# Altium project Honolulu.PrjPcb (part 1 of 3)
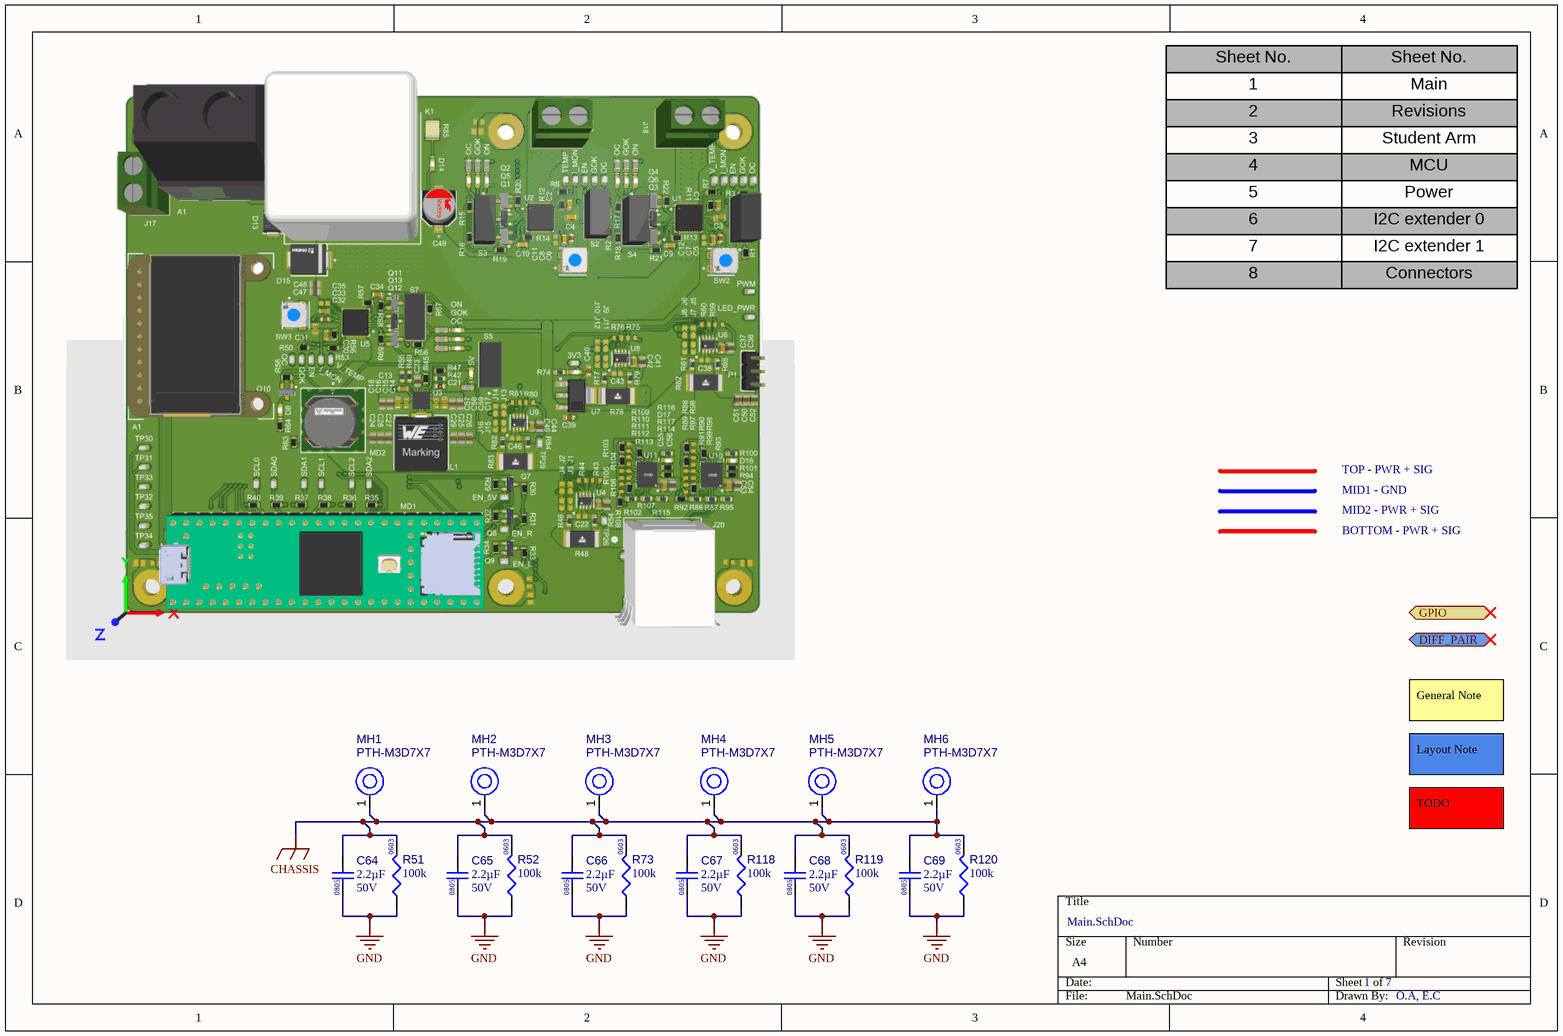
[diagram p0: Main.SchDoc]
8 sheets, 299 parts. Net scope: flat (ports and power ports of the same name join across sheets).
Board file: PCB1.PcbDoc
Sheets:
  Main.SchDoc
  Revisions.SchDoc
  Student Arm.SchDoc
  MCU.SchDoc
  Power.SchDoc
  I2C extender 0.SchDoc
  I2C extender 1.SchDoc
  Connectors.SchDoc

## Sheet Main.SchDoc: =DocumentName
size A4; SheetNumber: 1; SheetTotal: 7

### Parts
C64  value 2.2µF  Rated DC Voltage (URdc): 50V  Case/Package: 0805  [FP-CL21-IPC_C]  (hidden comment: CL21A225KBFNNNE)
C65  value 2.2µF  Rated DC Voltage (URdc): 50V  Case/Package: 0805  [FP-CL21-IPC_C]  (hidden comment: CL21A225KBFNNNE)
C66  value 2.2µF  Rated DC Voltage (URdc): 50V  Case/Package: 0805  [FP-CL21-IPC_C]  (hidden comment: CL21A225KBFNNNE)
C67  value 2.2µF  Rated DC Voltage (URdc): 50V  Case/Package: 0805  [FP-CL21-IPC_C]  (hidden comment: CL21A225KBFNNNE)
C68  value 2.2µF  Rated DC Voltage (URdc): 50V  Case/Package: 0805  [FP-CL21-IPC_C]  (hidden comment: CL21A225KBFNNNE)
C69  value 2.2µF  Rated DC Voltage (URdc): 50V  Case/Package: 0805  [FP-CL21-IPC_C]  (hidden comment: CL21A225KBFNNNE)
MH1  PTH-M3D7X7  [PTH-M2D5X5]
MH2  PTH-M3D7X7  [PTH-M2D5X5]
MH3  PTH-M3D7X7  [PTH-M2D5X5]
MH4  PTH-M3D7X7  [PTH-M2D5X5]
MH5  PTH-M3D7X7  [PTH-M2D5X5]
MH6  PTH-M3D7X7  [PTH-M2D5X5]
R51  value 100k  Case/Package: 0603  [RESC1608X55X25NL10T15]  (hidden comment: RC0603FR-07100KL)
R52  value 100k  Case/Package: 0603  [RESC1608X55X25NL10T15]  (hidden comment: RC0603FR-07100KL)
R73  value 100k  Case/Package: 0603  [RESC1608X55X25NL10T15]  (hidden comment: RC0603FR-07100KL)
R118  value 100k  Case/Package: 0603  [RESC1608X55X25NL10T15]  (hidden comment: RC0603FR-07100KL)
R119  value 100k  Case/Package: 0603  [RESC1608X55X25NL10T15]  (hidden comment: RC0603FR-07100KL)
R120  value 100k  Case/Package: 0603  [RESC1608X55X25NL10T15]  (hidden comment: RC0603FR-07100KL)

### Ports
DIFF_PAIR (bidir), GPIO (bidir)

### Nets
CHASSIS: C64.2 C65.2 C66.2 C67.2 C68.2 C69.2 MH1.1(H1) MH2.1(H1) MH3.1(H1) MH4.1(H1) MH5.1(H1) MH6.1(H1) R51.2 R52.2 R73.2 R118.2 R119.2 R120.2
GND: C64.1 C65.1 C66.1 C67.1 C68.1 C69.1 R51.1 R52.1 R73.1 R118.1 R119.1 R120.1

### Notes on the sheet
- Sheet No.
- 1
- Main
- 2
- 3
- 4
- Revisions
- Student Arm
- MCU
- 5
- 6
- Power
- I2C extender 0
- 7
- 8
- I2C extender 1
- Connectors
- TOP - PWR + SIG
- MID1 - GND
- MID2 - PWR + SIG
- BOTTOM - PWR + SIG
- General Note
- Layout Note
- TODO
- O.A, E.C

### Library data of the parts
C64-C69 = CMP-001-00099-1: Ceramic Capacitor, Multilayer, Ceramic, 50V, 10% +Tol, 10% -Tol, X5R, 15% TC, 2.2uF, Surface Mount, 0805; Multilayer: Yes; Dielectric Material: Ceramic; Length: 2mm; Pins: 2; Tolerance  (fill in as +-): 10%; RoHS Compliant: Yes; Package Style: SMTMeter; Reach SVHC Compliant: Yes; Min Operating Temperature: -55°C; Temperature Characteristics Code: X5R; Tolerance (fill in as +-): 10%; Capacitor Type: Ceramic; Width: 1.25mm; Terminal Finish: Nickel; Termination: Wraparound; Package Shape: Rectangular; Packaging: Tape and Reel; Mounting Technology: Surface Mount; JESD-609 Code: e3; Height: 1.25mm; Max Operating Temperature: 85°C
MH1-MH6 = CMP-00028-00009-3: M3 PTH (3.3mm), 7mm pad; Pins: 1
R51 R52 R73 R118-R120 = CMP-009-00195-1: Fixed Resistor, Metal Glaze/thick Film, 0.1W, 100000ohm, 75V, 1% +/-Tol, 100ppm/Cel, Surface Mount, 0603; Power: 100mW; Voltage Rating: 50V; Package Length: 1.6mm; Package Height: 0.45mm; Rated Temperature: 70°C; Package Width: 0.8mm; Temperature Coefficient: 100ppm/°C; Additional Feature: LASER TRIMMABLE; Pins: 2; Reach SVHC Compliant: Yes; Terminal Finish: Nickel; RoHS Compliant: Yes; Technology: METAL GLAZE/THICK FILM; JESD-609 Code: e3; Working Voltage: 75V; Construction: Chip; Mounting Technology: Surface Mount; Package Style: SMTMeter; Packaging: Tape and Reel; Min Operating Temperature: -55°C; Termination: Wraparound; Tolerance: 1%; Package Shape: Rectangular; Max Operating Temperature: 155°C; Resistor Type: FIXED RESISTOR

## Sheet Revisions.SchDoc
size A4; SheetNumber: 2; SheetTotal: 5
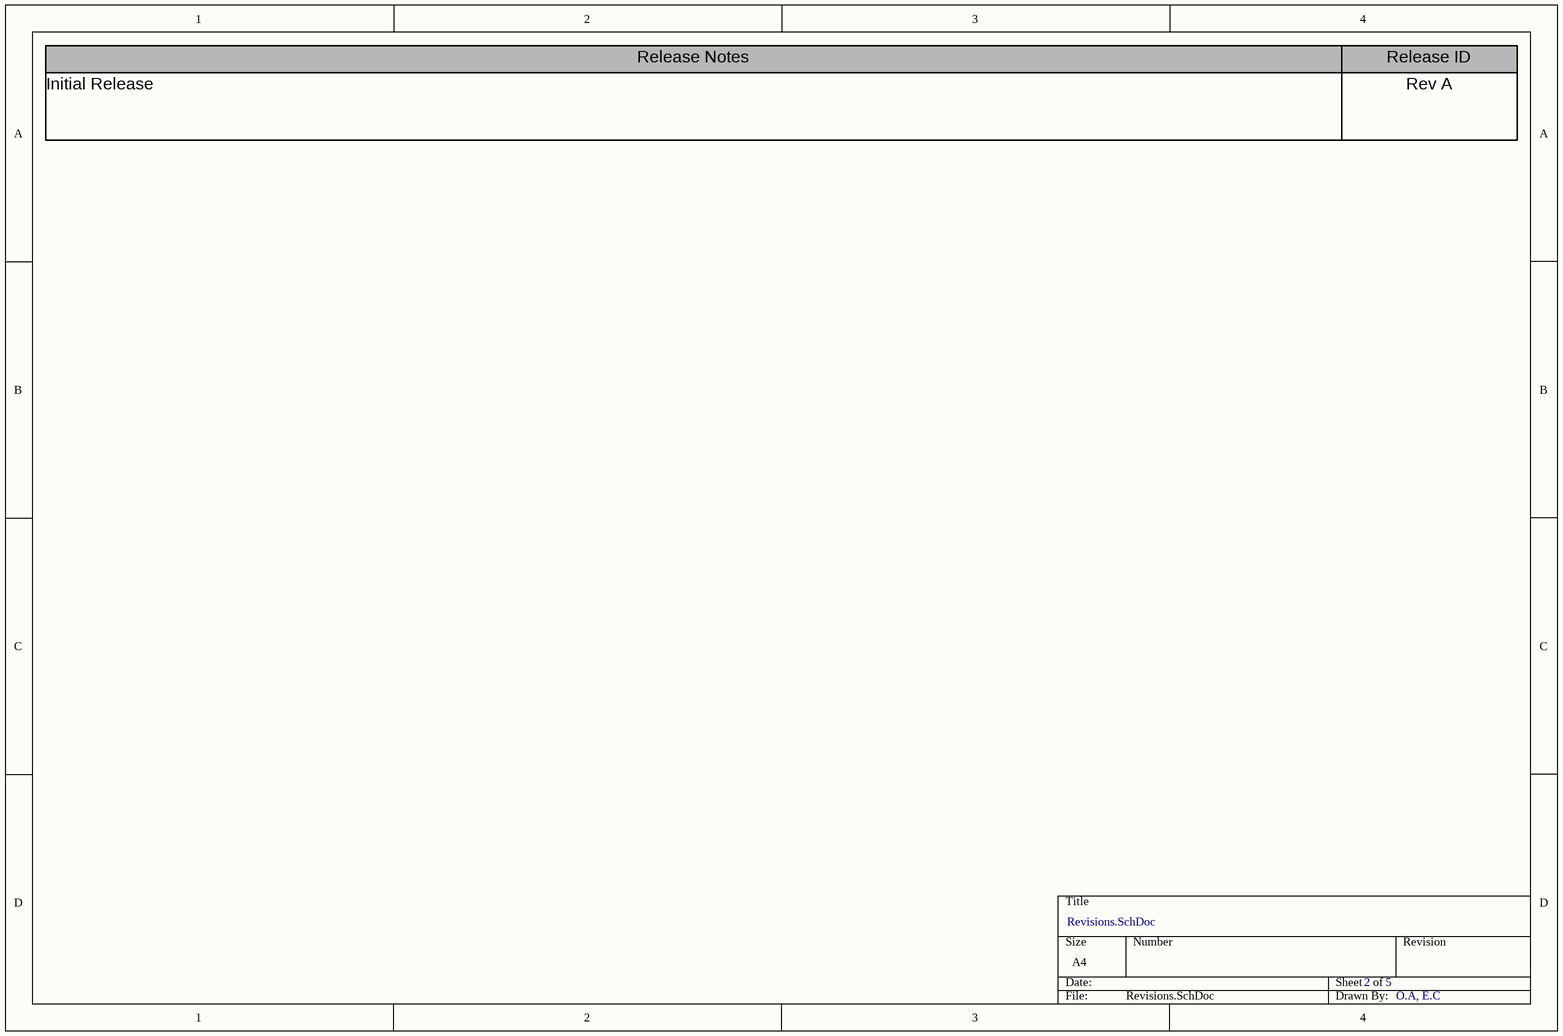
[diagram p1: Revisions.SchDoc]

### Notes on the sheet
- Release Notes
- Release ID
- Initial Release
- Rev A
- O.A, E.C

## Sheet Student Arm.SchDoc
size 431 x 279 mm; DrawnBy: O. A., E. C.; SheetNumber: 1; SheetTotal: 6
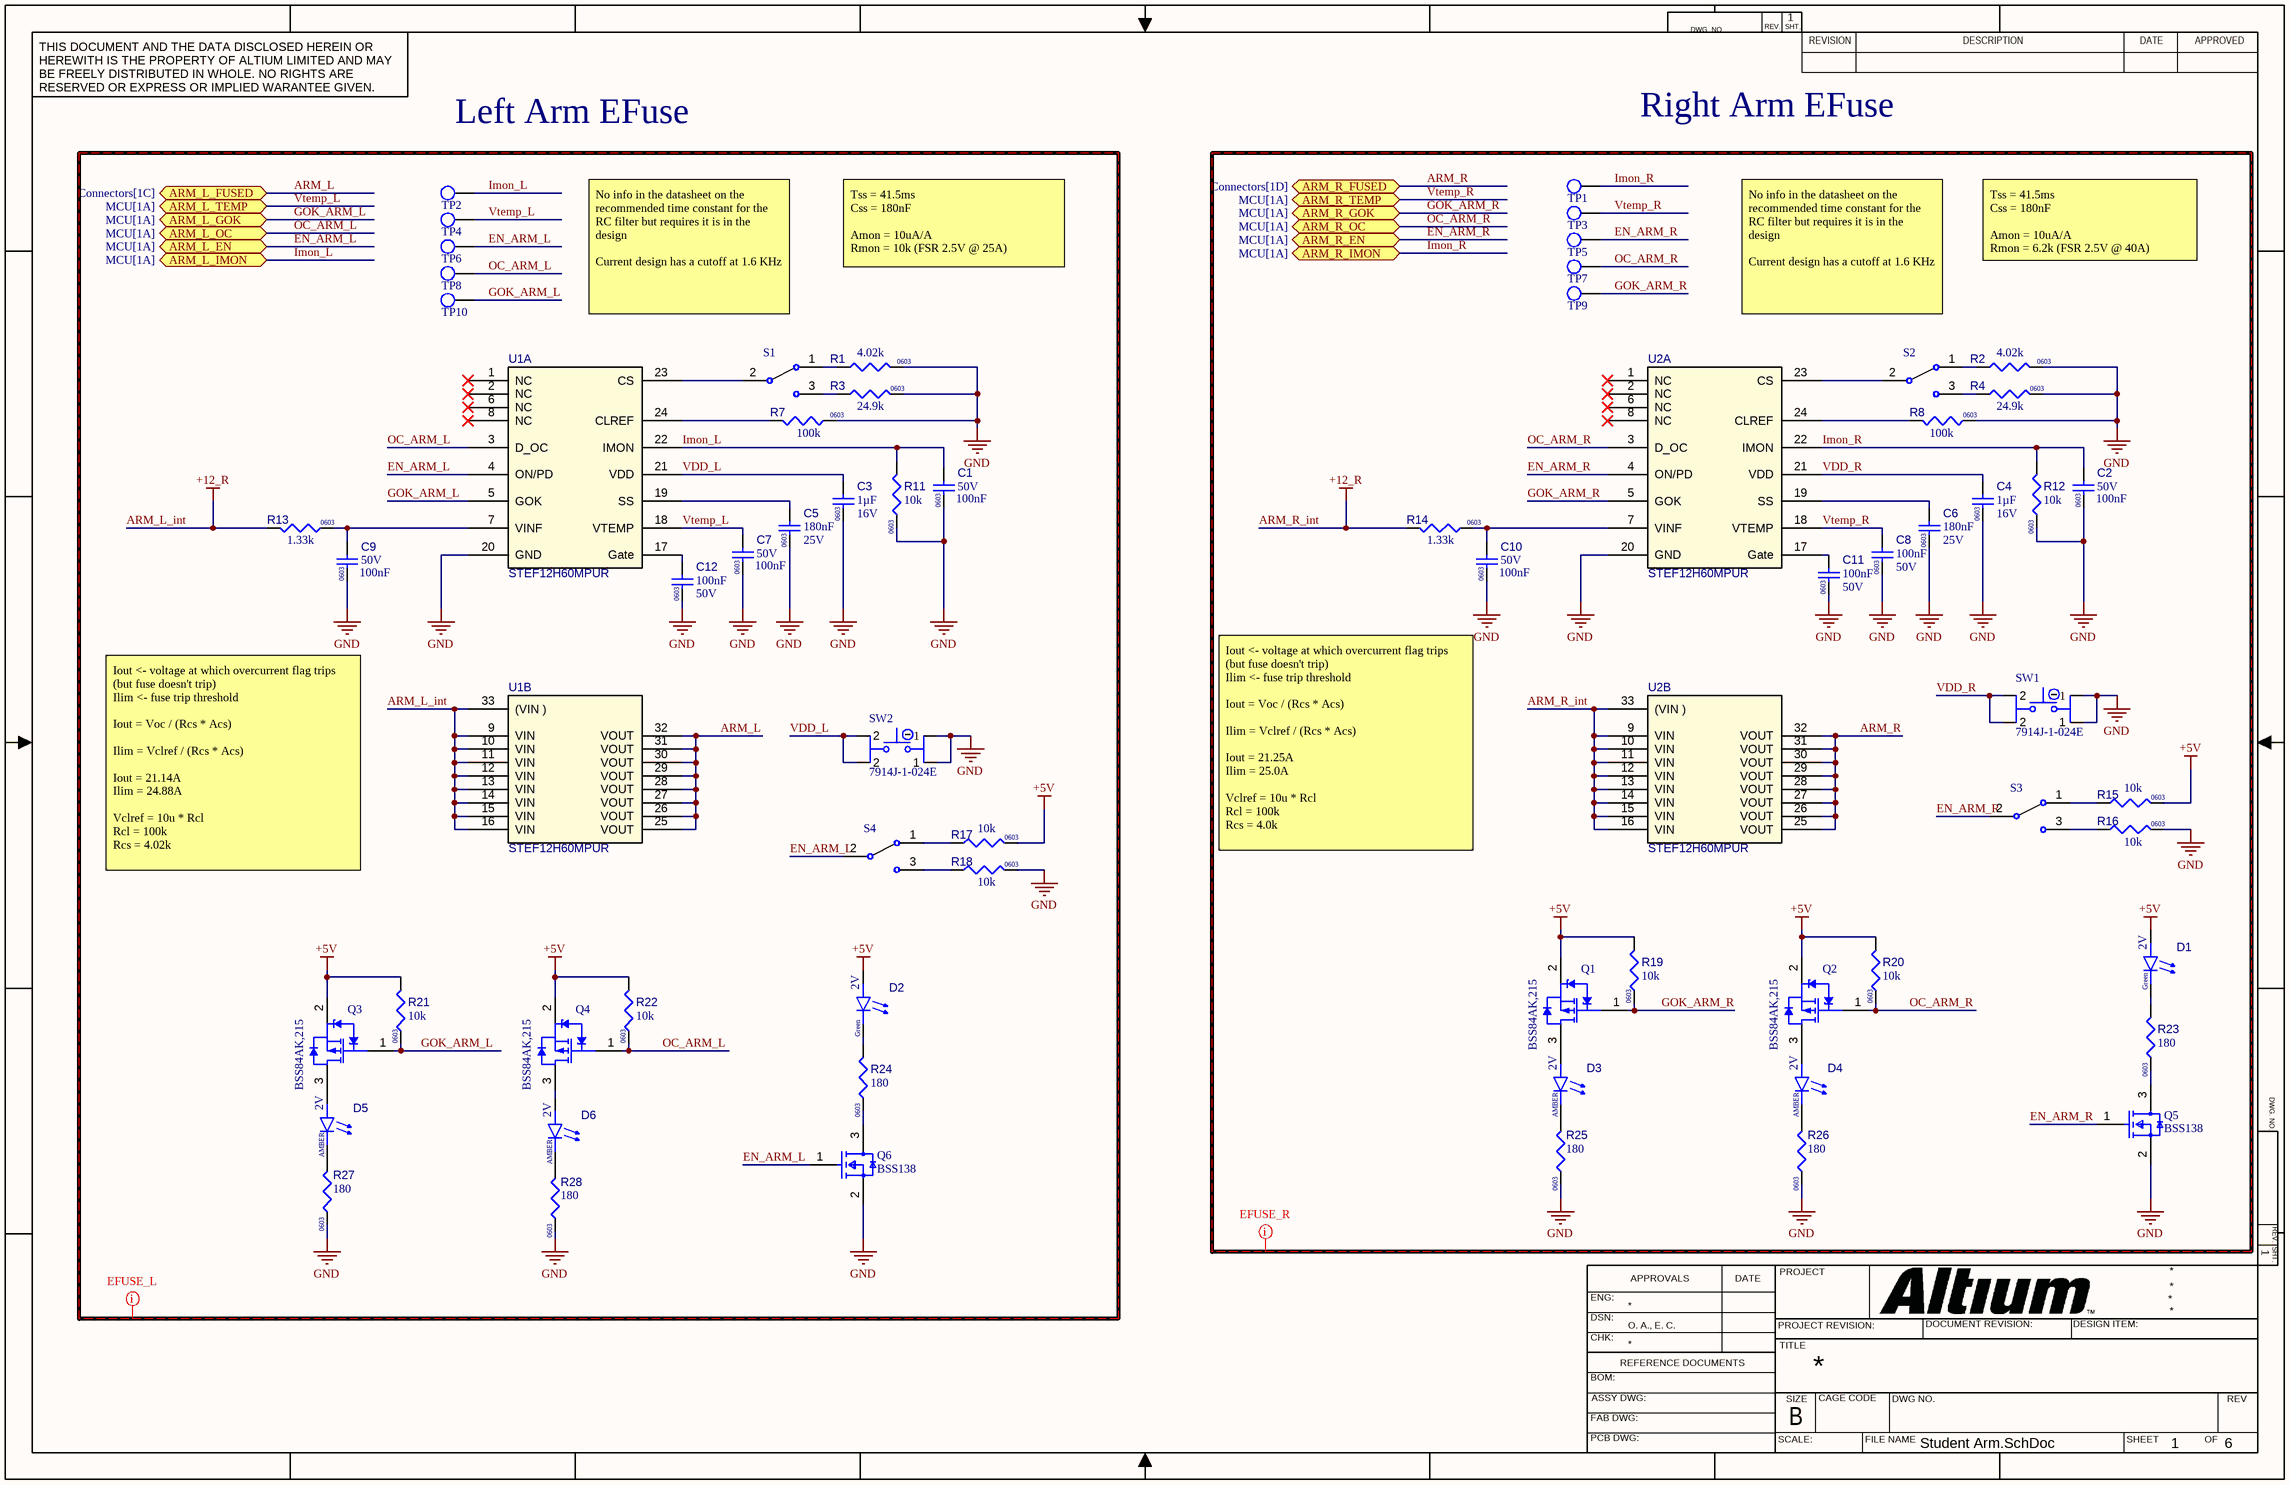
[diagram p2: Student Arm.SchDoc]

### Parts
C1  value 100nF  Voltage Rating: 50V  Case/Package: 0603  [CAPC1608X90X40NL10T20]  (hidden comment: Capacitor 100 nF +/-10% 50 V 0603)
C2  value 100nF  Voltage Rating: 50V  Case/Package: 0603  [CAPC1608X90X40NL10T20]  (hidden comment: Capacitor 100 nF +/-10% 50 V 0603)
C3  value 1µF  Case/Package: 0603  Voltage Rating: 16V  [CAPC1608X90X35NL15T15]  (hidden comment: Capacitor 1uF +/- 10% 16V 0603)
C4  value 1µF  Case/Package: 0603  Voltage Rating: 16V  [CAPC1608X90X35NL15T15]  (hidden comment: Capacitor 1uF +/- 10% 16V 0603)
C5  value 180nF  Case/Package: 0603  Rated DC Voltage (URdc): 25V  [FP-GCM188-0_1-IPC_C]  (hidden comment: GCM188R71E184KA55D)
C6  value 180nF  Case/Package: 0603  Rated DC Voltage (URdc): 25V  [FP-GCM188-0_1-IPC_C]  (hidden comment: GCM188R71E184KA55D)
C7  value 100nF  Voltage Rating: 50V  Case/Package: 0603  [CAPC1608X90X40NL10T20]  (hidden comment: Capacitor 100 nF +/-10% 50 V 0603)
C8  value 100nF  Voltage Rating: 50V  Case/Package: 0603  [CAPC1608X90X40NL10T20]  (hidden comment: Capacitor 100 nF +/-10% 50 V 0603)
C9  value 100nF  Voltage Rating: 50V  Case/Package: 0603  [CAPC1608X90X40NL10T20]  (hidden comment: Capacitor 100 nF +/-10% 50 V 0603)
C10  value 100nF  Voltage Rating: 50V  Case/Package: 0603  [CAPC1608X90X40NL10T20]  (hidden comment: Capacitor 100 nF +/-10% 50 V 0603)
C11  value 100nF  Voltage Rating: 50V  Case/Package: 0603  [CAPC1608X90X40NL10T20]  (hidden comment: Capacitor 100 nF +/-10% 50 V 0603)
C12  value 100nF  Voltage Rating: 50V  Case/Package: 0603  [CAPC1608X90X40NL10T20]  (hidden comment: Capacitor 100 nF +/-10% 50 V 0603)
D1  Forward Voltage: 2V  Color: Green  [WL-SMCW_0603_150060xx75000]  (hidden comment: 150060VS75000)
D2  Forward Voltage: 2V  Color: Green  [WL-SMCW_0603_150060xx75000]  (hidden comment: 150060VS75000)
D3  Forward Voltage: 2V  Colour: AMBER  [WL-SMCW_0603_150060xx75000]  (hidden comment: 150060AS75000)
D4  Forward Voltage: 2V  Colour: AMBER  [WL-SMCW_0603_150060xx75000]  (hidden comment: 150060AS75000)
D5  Forward Voltage: 2V  Colour: AMBER  [WL-SMCW_0603_150060xx75000]  (hidden comment: 150060AS75000)
D6  Forward Voltage: 2V  Colour: AMBER  [WL-SMCW_0603_150060xx75000]  (hidden comment: 150060AS75000)
Q1  BSS84AK,215  [NXP-SOT23_N]
Q2  BSS84AK,215  [NXP-SOT23_N]
Q3  BSS84AK,215  [NXP-SOT23_N]
Q4  BSS84AK,215  [NXP-SOT23_N]
Q5  BSS138  [FP-318-08-IPC_B]
Q6  BSS138  [FP-318-08-IPC_B]
R1  value 4.02k  Case/Package: 0603  [RESC1608X55X25NL10T15]  (hidden comment: RC0603FR-074K02L)
R2  value 4.02k  Case/Package: 0603  [RESC1608X55X25NL10T15]  (hidden comment: RC0603FR-074K02L)
R3  value 24.9k  Case/Package: 0603  [RESC1608X55X25NL10T15]  (hidden comment: RC0603FR-1024K9L)
R4  value 24.9k  Case/Package: 0603  [RESC1608X55X25NL10T15]  (hidden comment: RC0603FR-1024K9L)
R7  value 100k  Case/Package: 0603  [RESC1608X55X25NL10T15]  (hidden comment: RC0603FR-07100KL)
R8  value 100k  Case/Package: 0603  [RESC1608X55X25NL10T15]  (hidden comment: RC0603FR-07100KL)
R11  value 10k  Case/Package: 0603  [RESC1608X55X25NL10T15]  (hidden comment: Resistor 10k +/-1% 0603 100 mW)
R12  value 10k  Case/Package: 0603  [RESC1608X55X25NL10T15]  (hidden comment: Resistor 10k +/-1% 0603 100 mW)
R13  value 1.33k  Case/Package: 0603  [RESC1608X55X25NL10T15]  (hidden comment: RC0603FR-071K33L)
R14  value 1.33k  Case/Package: 0603  [RESC1608X55X25NL10T15]  (hidden comment: RC0603FR-071K33L)
R15  value 10k  Case/Package: 0603  [RESC1608X55X25NL10T15]  (hidden comment: Resistor 10k +/-1% 0603 100 mW)
R16  value 10k  Case/Package: 0603  [RESC1608X55X25NL10T15]  (hidden comment: Resistor 10k +/-1% 0603 100 mW)
R17  value 10k  Case/Package: 0603  [RESC1608X55X25NL10T15]  (hidden comment: Resistor 10k +/-1% 0603 100 mW)
R18  value 10k  Case/Package: 0603  [RESC1608X55X25NL10T15]  (hidden comment: Resistor 10k +/-1% 0603 100 mW)
R19  value 10k  Case/Package: 0603  [RESC1608X55X25NL10T15]  (hidden comment: Resistor 10k +/-1% 0603 100 mW)
R20  value 10k  Case/Package: 0603  [RESC1608X55X25NL10T15]  (hidden comment: Resistor 10k +/-1% 0603 100 mW)
R21  value 10k  Case/Package: 0603  [RESC1608X55X25NL10T15]  (hidden comment: Resistor 10k +/-1% 0603 100 mW)
R22  value 10k  Case/Package: 0603  [RESC1608X55X25NL10T15]  (hidden comment: Resistor 10k +/-1% 0603 100 mW)
R23  value 180  Case/Package: 0603  [RESC0603(1608)_N]  (hidden comment: RC0603JR-07180RL)
R24  value 180  Case/Package: 0603  [RESC0603(1608)_N]  (hidden comment: RC0603JR-07180RL)
R25  value 180  Case/Package: 0603  [RESC0603(1608)_N]  (hidden comment: RC0603JR-07180RL)
R26  value 180  Case/Package: 0603  [RESC0603(1608)_N]  (hidden comment: RC0603JR-07180RL)
R27  value 180  Case/Package: 0603  [RESC0603(1608)_N]  (hidden comment: RC0603JR-07180RL)
R28  value 180  Case/Package: 0603  [RESC0603(1608)_N]  (hidden comment: RC0603JR-07180RL)
S1  SLW-883935-2A-D  [SLW-883935-2A-D-Footprint-1]  (value not drawn)
S2  SLW-883935-2A-D  [SLW-883935-2A-D-Footprint-1]  (value not drawn)
S3  SLW-883935-2A-D  [SLW-883935-2A-D-Footprint-1]  (value not drawn)
S4  SLW-883935-2A-D  [SLW-883935-2A-D-Footprint-1]  (value not drawn)
SW1  7914J-1-024E  [FP-7914J-1-024E-MFG]
SW2  7914J-1-024E  [FP-7914J-1-024E-MFG]
TP1  RCUCTE  [FP-S2761-46R-MFG]  (value not drawn)
TP2  RCUCTE  [FP-S2761-46R-MFG]  (value not drawn)
TP3  RCUCTE  [FP-S2761-46R-MFG]  (value not drawn)
TP4  RCUCTE  [FP-S2761-46R-MFG]  (value not drawn)
TP5  RCUCTE  [FP-S2761-46R-MFG]  (value not drawn)
TP6  RCUCTE  [FP-S2761-46R-MFG]  (value not drawn)
TP7  RCUCTE  [FP-S2761-46R-MFG]  (value not drawn)
TP8  RCUCTE  [FP-S2761-46R-MFG]  (value not drawn)
TP9  RCUCTE  [FP-S2761-46R-MFG]  (value not drawn)
TP10  RCUCTE  [FP-S2761-46R-MFG]  (value not drawn)
U1  STEF12H60MPUR  [STEF12H60MPUR-Footprint-1]  (parts A,B of 2)
U2  STEF12H60MPUR  [STEF12H60MPUR-Footprint-1]  (parts A,B of 2)

### Ports
ARM_L_EN (bidir, see MCU[1A]), ARM_L_FUSED (bidir, see Connectors[1C]), ARM_L_GOK (bidir, see MCU[1A]), ARM_L_IMON (bidir, see MCU[1A]), ARM_L_OC (bidir, see MCU[1A]), ARM_L_TEMP (bidir, see MCU[1A]), ARM_R_EN (bidir, see MCU[1A]), ARM_R_FUSED (bidir, see Connectors[1D]), ARM_R_GOK (bidir, see MCU[1A]), ARM_R_IMON (bidir, see MCU[1A]), ARM_R_OC (bidir, see MCU[1A]), ARM_R_TEMP (bidir, see MCU[1A])

### Nets
+5V: D1.2(A) D2.2(A) Q1.2(S) Q2.2(S) Q3.2(S) Q4.2(S) R15.2 R17.2 R19.2 R20.2 R21.2 R22.2
ARM_L_int: R13.2 R14.2 U1.9(VIN) U1.10(VIN) U1.11(VIN) U1.12(VIN) U1.13(VIN) U1.14(VIN) U1.15(VIN) U1.16(VIN) U1.33((VIN_)) U2.9(VIN) U2.10(VIN) U2.11(VIN) U2.12(VIN) U2.13(VIN) U2.14(VIN) U2.15(VIN) U2.16(VIN) U2.33((VIN_))  [also labelled +12_R, ARM_R_int]
GND: C1.1 C2.1 C3.1 C4.1 C5.1 C6.1 C7.1 C8.1 C9.1 C10.1 C11.1 C12.1 Q5.2(S) Q6.2(S) R1.2 R2.2 R3.2 R4.2 R7.1 R8.1 R11.1 R12.1 R16.2 R18.2 R25.1 R26.1 R27.1 R28.1 SW1.1 SW1.4(1) SW2.1 SW2.4(1) U1.20(GND) U2.20(GND)
ARM_L: U1.25(VOUT) U1.26(VOUT) U1.27(VOUT) U1.28(VOUT) U1.29(VOUT) U1.30(VOUT) U1.31(VOUT) U1.32(VOUT) ; port ARM_L_FUSED
ARM_R: U2.25(VOUT) U2.26(VOUT) U2.27(VOUT) U2.28(VOUT) U2.29(VOUT) U2.30(VOUT) U2.31(VOUT) U2.32(VOUT) ; port ARM_R_FUSED
EN_ARM_L: Q6.1(G) S4.2(COM) TP6.1 U1.4(ON/PD) ; port ARM_L_EN
EN_ARM_R: Q5.1(G) S3.2(COM) TP5.1 U2.4(ON/PD) ; port ARM_R_EN
GOK_ARM_L: Q3.1(G) R21.1 TP10.1 U1.5(GOK) ; port ARM_L_GOK
GOK_ARM_R: Q1.1(G) R19.1 TP9.1 U2.5(GOK) ; port ARM_R_GOK
Imon_L: C1.2 R11.2 TP2.1 U1.22(IMON) ; port ARM_L_IMON
Imon_R: C2.2 R12.2 TP1.1 U2.22(IMON) ; port ARM_R_IMON
OC_ARM_L: Q4.1(G) R22.1 TP8.1 U1.3(D_OC) ; port ARM_L_OC
OC_ARM_R: Q2.1(G) R20.1 TP7.1 U2.3(D_OC) ; port ARM_R_OC
VDD_L: C3.2 SW2.2 SW2.3(2) U1.21(VDD)
VDD_R: C4.2 SW1.2 SW1.3(2) U2.21(VDD)
Vtemp_L: C7.2 TP4.1 U1.18(VTEMP) ; port ARM_L_TEMP
Vtemp_R: C8.2 TP3.1 U2.18(VTEMP) ; port ARM_R_TEMP
NetC5_2: C5.2 U1.19(SS)
NetC6_2: C6.2 U2.19(SS)
NetC9_2: C9.2 R13.1 U1.7(VINF)
NetC10_2: C10.2 R14.1 U2.7(VINF)
NetC11_2: C11.2 U2.17(Gate)
NetC12_2: C12.2 U1.17(Gate)
NetD1_1: D1.1(K) R23.2
NetD2_1: D2.1(K) R24.2
NetD3_1: D3.1(K) R25.2
NetD3_2: D3.2(A) Q1.3(D)
NetD4_1: D4.1(K) R26.2
NetD4_2: D4.2(A) Q2.3(D)
NetD5_1: D5.1(K) R27.2
NetD5_2: D5.2(A) Q3.3(D)
NetD6_1: D6.1(K) R28.2
NetD6_2: D6.2(A) Q4.3(D)
NetQ5_3: Q5.3(D) R23.1
NetQ6_3: Q6.3(D) R24.1
NetR1_1: R1.1 S1.1(NC)
NetR2_1: R2.1 S2.1(NC)
NetR3_1: R3.1 S1.3(NO)
NetR4_1: R4.1 S2.3(NO)
NetR7_2: R7.2 U1.24(CLREF)
NetR8_2: R8.2 U2.24(CLREF)
NetR15_1: R15.1 S3.1(NC)
NetR16_1: R16.1 S3.3(NO)
NetR17_1: R17.1 S4.1(NC)
NetR18_1: R18.1 S4.3(NO)
NetS1_2: S1.2(COM) U1.23(CS)
NetS2_2: S2.2(COM) U2.23(CS)

Not connected (* = marked no-connect by the designer): U1 1(NC)* 2(NC)* 6(NC)* 8(NC)*; U2 1(NC)* 2(NC)* 6(NC)* 8(NC)*

### Layout directives
mark named EFUSE_L: +5V, +12_R, ARM_L, ARM_L_int, EN_ARM_L, GND, GOK_ARM_L, Imon_L, OC_ARM_L, VDD_L, Vtemp_L
mark named EFUSE_R: +5V, +12_R, ARM_R, ARM_R_int, EN_ARM_R, GND, GOK_ARM_R, Imon_R, OC_ARM_R, VDD_R, Vtemp_R

### Notes on the sheet
- Left Arm EFuse
- Right Arm EFuse
- Tss = 41.5ms
  Css = 180nF
  Amon = 10uA/A
  Rmon = 10k (FSR 2.5V @ 25A)
- Tss = 41.5ms
  Css = 180nF
  Amon = 10uA/A
  Rmon = 6.2k (FSR 2.5V @ 40A)
- No info in the datasheet on the recommended time constant for the RC filter but requires it is in the design
  Current design has a cutoff at 1.6 KHz
- Iout <- voltage at which overcurrent flag trips (but fuse doesn't trip)
  Ilim <- fuse trip threshold
  Iout = Voc / (Rcs * Acs)
  Ilim = Vclref / (Rcs * Acs)
  Iout = 21.14A
  Ilim = 24.88A
  Vclref = 10u * Rcl
  Rcl = 100k
  Rcs = 4.02k
- Iout <- voltage at which overcurrent flag trips (but fuse doesn't trip)
  Ilim <- fuse trip threshold
  Iout = Voc / (Rcs * Acs)
  Ilim = Vclref / (Rcs * Acs)
  Iout = 21.25A
  Ilim = 25.0A
  Vclref = 10u * Rcl
  Rcl = 100k
  Rcs = 4.0k
- DWG. NO.
- REV.
- SHT.
- THIS DOCUMENT AND THE DATA DISCLOSED HEREIN OR HEREWITH IS THE PROPERTY OF ALTIUM LIMITED AND MAY BE FREELY DISTRIBUTED IN WHOLE. NO RIGHTS ARE RESERVED OR EXPRESS OR IMPLIED WARANTEE GIVEN.
- REVISION
- DESCRIPTION
- DATE
- APPROVED
- ENG:
- APPROVALS
- PROJECT
- DSN:
- CHK:
- REFERENCE DOCUMENTS
- PROJECT REVISION:
- TITLE
- DOCUMENT REVISION:
- DESIGN ITEM:
- BOM:
- FAB DWG:
- PCB DWG:
- ASSY DWG:
- SCALE:
- SIZE
- B
- CAGE CODE
- FILE NAME
- DWG NO.
- SHEET
- OF
- REV

### Library data of the parts
C1 C2 C7-C12 = CMP-001-00017-8: Chip Capacitor, 100 nF, +/- 10%, 50 V, 0603 (1608 Metric); Capacitor Type: Ceramic; Tolerance: 10%; Mounting Technology: SM; Max Operating Temperature: 125°C; RoHS Compliant: True; Pins: 2; Min Operating Temperature: -55°C
C3 C4 = CMP-001-00004-8: Chip Capacitor, 1 uF, +/- 10%, 16 V, 0603 (1608 Metric); Capacitor Type: Ceramic; Min Operating Temperature: -55°C; Max Operating Temperature: 125°C; Mounting Technology: SM; Tolerance: 10%; Pins: 2; RoHS Compliant: True
C5 C6 = CMP-001-00098-1: Ceramic Capacitor, Multilayer, Ceramic, 25V, 10% +Tol, 10% -Tol, X7R, 15% TC, 0.18uF, Surface Mount, 0603; Reference Standard: AEC-Q200; Multilayer: Yes; Tolerance  (fill in as +-): 10%; JESD-609 Code: e3; Dielectric Material: Ceramic; RoHS Compliant: Yes; Terminal Finish: Nickel; Capacitor Type: Ceramic; Max Operating Temperature: 125°C; Temperature Characteristics Code: X7R; Tolerance (fill in as +-): 10%; Pins: 2; Min Operating Temperature: -55°C; Height: 0.8mm; Packaging: Tape and Reel; Mounting Technology: Surface Mount; Package Shape: Rectangular; Width: 0.8mm; Package Style: SMTMeter; Reach SVHC Compliant: Yes; Termination: Wraparound; Length: 1.6mm
D1 D2 = CMP-007-00045-1: Single Color LED, Bright Green, Water Clear, 1.1mm; Viewing Angle: 140°; Shape: Rectangular; Overall Height: 0.7mm; Forward Current: 30mA; Channels: 1; Luminous Intensity-Nom: 40mcd; Size: 1.1mm; Pins: 2; Optoelectronic Device Type: SINGLE COLOR LED; Mounting Technology: Surface Mount; Min Operating Temperature: -40°C; RoHS Compliant: Yes; Lens Style: WATER CLEAR; Max Operating Temperature: 85°C; Reach SVHC Compliant: Yes; Packaging: Tape and Reel; Terminal Pitch: 1.6mm
D3-D6 = CMP-007-00044-3: Single Color LED, Amber, Water Clear, 1.1mm; Overall Height: 0.7mm; Viewing Angle: 140°; Channels: 1; Luminous Intensity-Nom: 430mcd; Shape: Rectangular; Forward Current: 30mA; Min Operating Temperature: -40°C; Optoelectronic Device Type: SINGLE COLOR LED; Mounting Technology: Surface Mount; Terminal Pitch: 1.6mm; Packaging: Tape and Reel; Pins: 2; RoHS Compliant: Yes; Max Operating Temperature: 85°C; Lens Style: WATER CLEAR; Reach SVHC Compliant: Yes; Size: 1.1mm
Q1-Q4 = CMP-1259-00086-1: P-Channel Trench MOSFET, -50 V, -0.18 A, -55 to 150 degC, 3-Pin SOT23, Tape and Reel; Manufacturer: NXP Semiconductors; Automotive Qualified: Y; Packing: Tape & Reel; Channel Type: P; VGSth [typ] (V): -1.6; IDM [max] (A): -0.7; Code_JEDEC: TO-236AB; DatasheetVersion: Rev. 1; ID [max] (A): -0.18; Mounting Technology: Surface Mount; ComponentLink3URL: http://www.nxp.com/documents/outline_drawing/sot023_po.pdf; ComponentLink1Description: Manufacturer URL; PackageVersion: 06-03-16, 03/2006; ComponentLink2Description: Datasheet; PackageReference: SOT23; VDS [max] (V): -50; PackageDescription: 3-Pin Small Outline Transistor Package, Body 2.9 x 1.3 mm, Pitch 0.95 mm; ComponentLink2URL: http://www.nxp.com/documents/data_sheet/BSS84AK.pdf; ComponentLink3Description: Package Specification; ComponentLink1URL: http://www.nxp.com/; PartNumber: BSS84AK,215
Q5 Q6 = CMP-07173-000101-1: MOSFET N-CH 50V 220MA SOT-23; Turn-Off Delay Time: 20ns; Element Configuration: Single; Rds On Max: 3.5R; Gate to Source Voltage (Vgs): 20V; Threshold Voltage: 1.3V; Number of Elements: 1; Power Dissipation: 360mW; Rise Time: 9ns; Turn-On Delay Time: 2.5ns; Input Capacitance: 27pF; On-State Resistance: 6R; Lead Free: Lead Free; Length: 2.92mm; Width: 1.3mm; Drain to Source Breakdown Voltage: 50V; Min Operating Temperature: -55°C; REACH SVHC: No SVHC; Packaging: Tape and Reel; Radiation Hardening: No; Height: 0.93mm; Drain to Source Voltage (Vdss): 50V; Current Rating: 220mA; Voltage Rating (DC): 50V; Weight: 0.03g; Continuous Drain Current (ID): 220mA; Number of Pins: 3; Nominal Vgs: 1.3V; Max Power Dissipation: 360mW; Fall Time: 9ns; Drain to Source Resistance: 3.5R; Contact Plating: Tin; Case/Package: SOT-23; Package Quantity: 1; Dual Supply Voltage: 50V; Mount: Surface Mount; Termination: SMD/SMT; Max Operating Temperature: 150°C
R1 R2 = CMP-009-00200-1: Fixed Resistor, Metal Glaze/thick Film, 0.1W, 4020ohm, 75V, 1% +/-Tol, 100ppm/Cel, Surface Mount, 0603; Voltage Rating: 50V; Temperature Coefficient: 100ppm/°C; Rated Temperature: 70°C; Power: 100mW; Package Width: 0.8mm; Package Height: 0.45mm; Additional Feature: LASER TRIMMABLE; Package Length: 1.6mm; Working Voltage: 75V; Resistor Type: FIXED RESISTOR; Terminal Finish: Nickel; Pins: 2; Tolerance: 1%; RoHS Compliant: Yes; Packaging: Tape and Reel; Technology: METAL GLAZE/THICK FILM; Package Style: SMTMeter; Termination: Wraparound; Construction: Chip; Reach SVHC Compliant: Yes; Mounting Technology: Surface Mount; Min Operating Temperature: -55°C; Max Operating Temperature: 155°C; JESD-609 Code: e3; Package Shape: Rectangular
R3 R4 = CMP-009-00196-1: Fixed Resistor, Metal Glaze/thick Film, 0.1W, 24900ohm, 75V, 1% +/-Tol, 100ppm/Cel, Surface Mount, 0603; Temperature Coefficient: 100ppm/°C; Power: 100mW; Package Width: 0.8mm; Voltage Rating: 50V; Additional Feature: LASER TRIMMABLE; Rated Temperature: 70°C; Package Length: 1.6mm; Package Height: 0.45mm; Resistor Type: FIXED RESISTOR; Construction: Chip; Max Operating Temperature: 155°C; Termination: Wraparound; Packaging: Tape and Reel; Tolerance: 1%; Mounting Technology: Surface Mount; Reach SVHC Compliant: Yes; Package Style: SMTMeter; Min Operating Temperature: -55°C; Pins: 2; Package Shape: Rectangular; RoHS Compliant: Yes; Working Voltage: 75V; Technology: METAL GLAZE/THICK FILM; JESD-609 Code: e3; Terminal Finish: Nickel
R7 R8 = CMP-009-00195-1: as R51 on sheet Main; Pins: 2; Reach SVHC Compliant: Yes; Terminal Finish: Nickel; RoHS Compliant: Yes; Technology: METAL GLAZE/THICK FILM; JESD-609 Code: e3; Working Voltage: 75V; Construction: Chip; Mounting Technology: Surface Mount; Package Style: SMTMeter; Packaging: Tape and Reel; Min Operating Temperature: -55°C; Termination: Wraparound; Tolerance: 1%; Package Shape: Rectangular; Max Operating Temperature: 155°C; Resistor Type: FIXED RESISTOR
R11 R12 R15-R22 = CMP-009-00017-7: Chip Resistor, 10 KOhm, +/- 1%, 01 W, -55 to 155 degC, 0603 (1608 Metric); Voltage Rating: 50V; Power: 100mW; RoHS Compliant: True; Min Operating Temperature: -55°C; Pins: 2; Mounting Technology: SM; Max Operating Temperature: 155°C; Tolerance: 1%
R13 R14 = CMP-009-00193-2: Fixed Resistor, Metal Glaze/thick Film, 0.1W, 1330ohm, 75V, 1% +/-Tol, 100ppm/Cel, Surface Mount, 0603; Temperature Coefficient: 100ppm/°C; Additional Feature: LASER TRIMMABLE; Voltage Rating: 50V; Rated Temperature: 70°C; Power: 100mW; Package Height: 0.45mm; Package Width: 0.8mm; Package Length: 1.6mm; Tolerance: 1%; Package Shape: Rectangular; Pins: 2; Termination: Wraparound; Packaging: Tape and Reel; Technology: METAL GLAZE/THICK FILM; Package Style: SMTMeter; JESD-609 Code: e3; Construction: Chip; Working Voltage: 75V; RoHS Compliant: Yes; Min Operating Temperature: -55°C; Mounting Technology: Surface Mount; Reach SVHC Compliant: Yes; Terminal Finish: Nickel; Max Operating Temperature: 155°C; Resistor Type: FIXED RESISTOR
R23-R28 = CMP-009-00178-1: Fixed Resistor, Metal Glaze/thick Film, 0.1W, 180ohm, 75V, 5% +/-Tol, 100ppm/Cel, Surface Mount, 0603; Power: 100mW; Tolerance: 5%; Pins: 2; Mounting Technology: Surface Mount; RoHS Compliant: Yes; Max Operating Temperature: 155°C; Min Operating Temperature: -55°C
S1-S4 = CMP-011-00017-1: 8.8 X 3.9 X 3.5 Mm, 2 Mm Raised
SW1 SW2 = CMP-00028-00008-3: Keypad Switch, 1 Switches, SPST, Momentary, 0.1A, 16VDC, 3.92N, 0 PCB Hole Cnt, Solder Terminal, Surface Mount-straight; Manufacturer Series: 7914; End Contact Material: Stainless Steel; Actuator Angle: 0°; Actuator Length: 0inch; Contact DC Max Rating R Load: .1A@16VDC; Contact Resistance: 0.1mR; Circuit Configuration: 1X1; Center Contact Plating: Gold; Actuator Type: FLUSH TYPE; Insulation Resistance: 100MR; Number of Switches: 1; Contact Timing: SNAP ACTION; Body Height: 2.54mm; Body Breadth: 5inch; Contact Current(DC)-Max: 100mA; Contact Voltage(DC)-Max: 16V; Body Length or Diameter: 5mm; Sealing: WATER PROOF; Dielectric Withstand Volts: 250VACV; Contact Function: N.O.-N.C.; Actuator Material: Rubber; Housing Material: Stainless Steel; Reach SVHC Compliant: Yes; JESD-609 Code: e4; Packaging: Tape and Reel; Max Operating Temperature: 125°C; Min Operating Temperature: -55°C; Insulation Material: Thermoplastic; Mounting Technology: Surface Mount; Switch Type: Keypad; Switch Action: MOMENTARY; Contact Material: Stainless Steel; Terminal Finish: Nickel; Terminal Length: 0inch; Operating Force-Max: 3.92N; Termination: Solder; Switch Function: SPST; End Contact Plating: Gold; Bushing Length: 0inch; Bushing Diameter: 0inch; RoHS Compliant: Yes; Terminal Material: Bronze
TP1-TP10 = CMP-002-00072-5: Test point; Connector Type: Interconnection Device; Pins: 2; Max Operating Temperature: 125°C; Case/Package: 0603; Mounting Technology: Surface Mount; RoHS Compliant: Yes; Min Operating Temperature: -55°C
U1 U2 = CMP-005-00016-4: IC ELECTRONIC FUSE 32QFN; Case/Package: 32QFN

## Sheet MCU.SchDoc
size A4; SheetNumber: 2; SheetTotal: 6
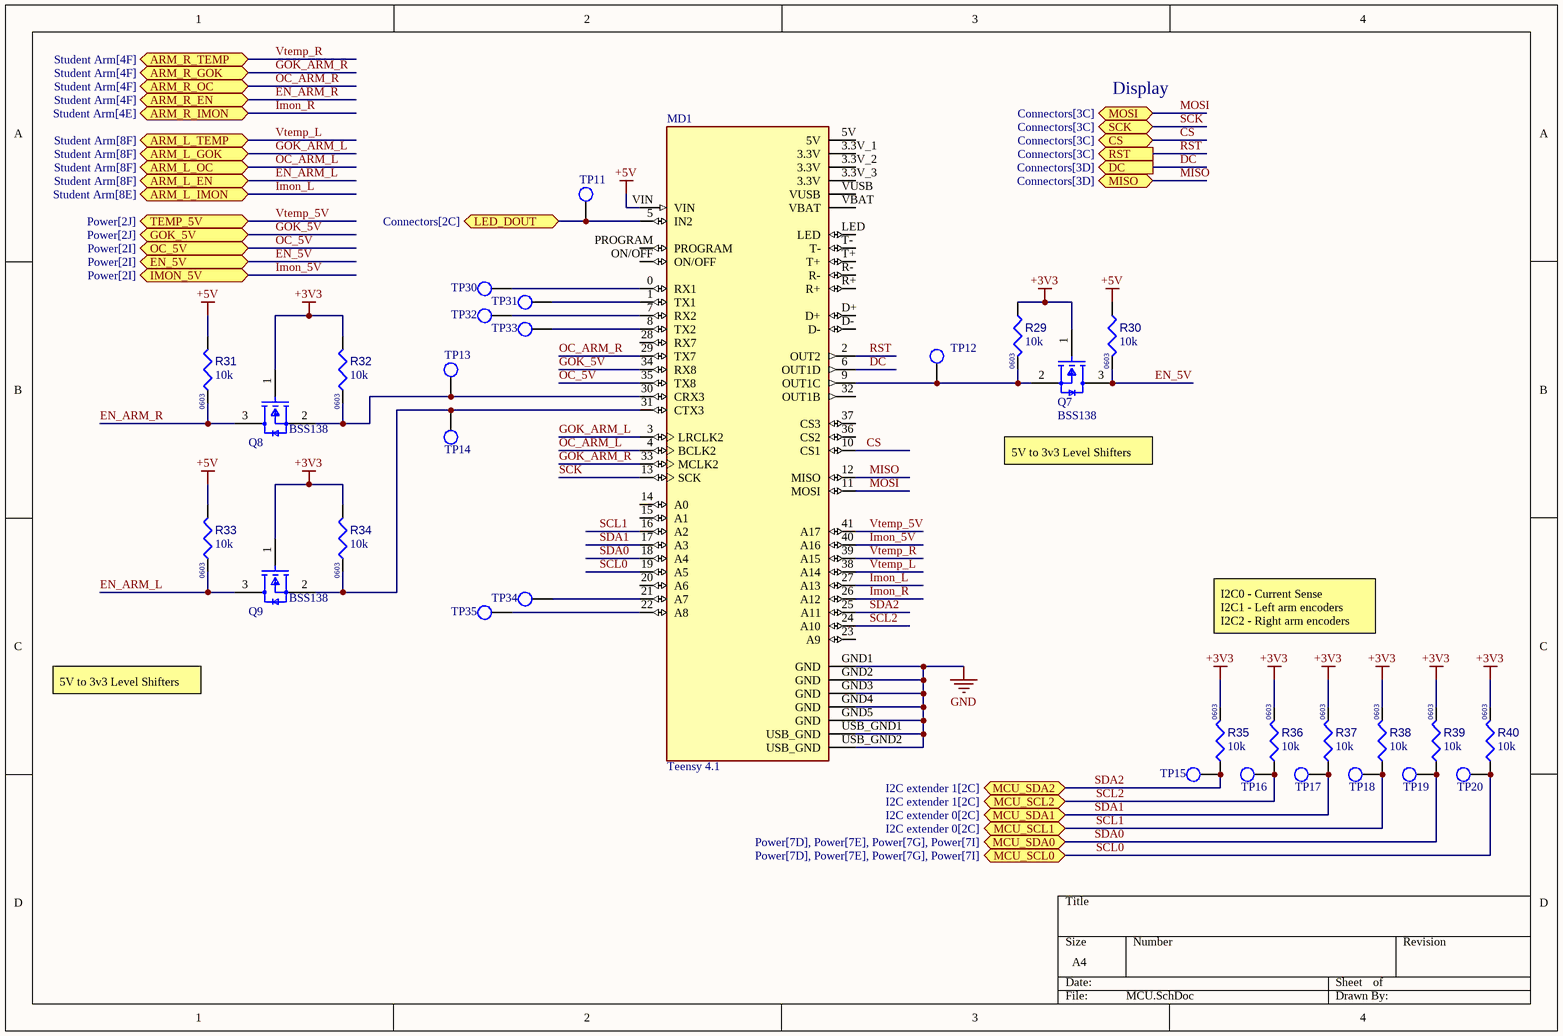
[diagram p3: MCU.SchDoc]

### Parts
MD1  Teensy 4.1  [FP-DEV-16771-MFG]
Q7  BSS138  [FP-318-08-IPC_B]
Q8  BSS138  [FP-318-08-IPC_B]
Q9  BSS138  [FP-318-08-IPC_B]
R29  value 10k  Case/Package: 0603  [RESC1608X55X25NL10T15]  (hidden comment: Resistor 10k +/-1% 0603 100 mW)
R30  value 10k  Case/Package: 0603  [RESC1608X55X25NL10T15]  (hidden comment: Resistor 10k +/-1% 0603 100 mW)
R31  value 10k  Case/Package: 0603  [RESC1608X55X25NL10T15]  (hidden comment: Resistor 10k +/-1% 0603 100 mW)
R32  value 10k  Case/Package: 0603  [RESC1608X55X25NL10T15]  (hidden comment: Resistor 10k +/-1% 0603 100 mW)
R33  value 10k  Case/Package: 0603  [RESC1608X55X25NL10T15]  (hidden comment: Resistor 10k +/-1% 0603 100 mW)
R34  value 10k  Case/Package: 0603  [RESC1608X55X25NL10T15]  (hidden comment: Resistor 10k +/-1% 0603 100 mW)
R35  value 10k  Case/Package: 0603  [RESC1608X55X25NL10T15]  (hidden comment: Resistor 10k +/-1% 0603 100 mW)
R36  value 10k  Case/Package: 0603  [RESC1608X55X25NL10T15]  (hidden comment: Resistor 10k +/-1% 0603 100 mW)
R37  value 10k  Case/Package: 0603  [RESC1608X55X25NL10T15]  (hidden comment: Resistor 10k +/-1% 0603 100 mW)
R38  value 10k  Case/Package: 0603  [RESC1608X55X25NL10T15]  (hidden comment: Resistor 10k +/-1% 0603 100 mW)
R39  value 10k  Case/Package: 0603  [RESC1608X55X25NL10T15]  (hidden comment: Resistor 10k +/-1% 0603 100 mW)
R40  value 10k  Case/Package: 0603  [RESC1608X55X25NL10T15]  (hidden comment: Resistor 10k +/-1% 0603 100 mW)
TP11  RCUCTE  [FP-S2761-46R-MFG]  (value not drawn)
TP12  RCUCTE  [FP-S2761-46R-MFG]  (value not drawn)
TP13  RCUCTE  [FP-S2761-46R-MFG]  (value not drawn)
TP14  RCUCTE  [FP-S2761-46R-MFG]  (value not drawn)
TP15  RCUCTE  [FP-S2761-46R-MFG]  (value not drawn)
TP16  RCUCTE  [FP-S2761-46R-MFG]  (value not drawn)
TP17  RCUCTE  [FP-S2761-46R-MFG]  (value not drawn)
TP18  RCUCTE  [FP-S2761-46R-MFG]  (value not drawn)
TP19  RCUCTE  [FP-S2761-46R-MFG]  (value not drawn)
TP20  RCUCTE  [FP-S2761-46R-MFG]  (value not drawn)
TP30  RCUCTE  [FP-S2761-46R-MFG]  (value not drawn)
TP31  RCUCTE  [FP-S2761-46R-MFG]  (value not drawn)
TP32  RCUCTE  [FP-S2761-46R-MFG]  (value not drawn)
TP33  RCUCTE  [FP-S2761-46R-MFG]  (value not drawn)
TP34  RCUCTE  [FP-S2761-46R-MFG]  (value not drawn)
TP35  RCUCTE  [FP-S2761-46R-MFG]  (value not drawn)

### Ports
ARM_L_EN (bidir, see Student Arm[8F]), ARM_L_GOK (bidir, see Student Arm[8F]), ARM_L_IMON (bidir, see Student Arm[8E]), ARM_L_OC (bidir, see Student Arm[8F]), ARM_L_TEMP (bidir, see Student Arm[8F]), ARM_R_EN (bidir, see Student Arm[4F]), ARM_R_GOK (bidir, see Student Arm[4F]), ARM_R_IMON (bidir, see Student Arm[4E]), ARM_R_OC (bidir, see Student Arm[4F]), ARM_R_TEMP (bidir, see Student Arm[4F]), CS (bidir, see Connectors[3C]), DC (out, see Connectors[3D]), EN_5V (bidir, see Power[2I]), GOK_5V (bidir, see Power[2J]), IMON_5V (bidir, see Power[2I]), LED_DOUT (bidir, see Connectors[2C]), MCU_SCL0 (bidir, see Power[7D], Power[7E], Power[7G], Power[7I]), MCU_SCL1 (bidir, see I2C extender 0[2C]), MCU_SCL2 (bidir, see I2C extender 1[2C]), MCU_SDA0 (bidir, see Power[7D], Power[7E], Power[7G], Power[7I]), MCU_SDA1 (bidir, see I2C extender 0[2C]), MCU_SDA2 (bidir, see I2C extender 1[2C]), MISO (bidir, see Connectors[3D]), MOSI (bidir, see Connectors[3C]), OC_5V (bidir, see Power[2I]), RST (out, see Connectors[3C]), SCK (bidir, see Connectors[3C]), TEMP_5V (bidir, see Power[2J])

### Nets
+3V3: Q7.1(G) Q8.1(G) Q9.1(G) R29.2 R32.2 R34.2 R35.2 R36.2 R37.2 R38.2 R39.2 R40.2
+5V: MD1.VIN R30.2 R31.2 R33.2
GND: MD1.GND1(GND) MD1.GND2(GND) MD1.GND3(GND) MD1.GND4(GND) MD1.GND5(GND) MD1.USB_GND1(USB_GND) MD1.USB_GND2(USB_GND)
CS: MD1.10(CS1) ; port CS
DC: MD1.6(OUT1D) ; port DC
EN_5V: Q7.3(D) R30.1 ; port EN_5V
EN_ARM_L: Q9.3(D) R33.1 ; port ARM_L_EN
EN_ARM_R: Q8.3(D) R31.1 ; port ARM_R_EN
GOK_5V: MD1.34(RX8) ; port GOK_5V
GOK_ARM_L: MD1.3(LRCLK2) ; port ARM_L_GOK
GOK_ARM_R: MD1.33(MCLK2) ; port ARM_R_GOK
Imon_5V: MD1.40(A16) ; port IMON_5V
Imon_L: MD1.27(A13) ; port ARM_L_IMON
Imon_R: MD1.26(A12) ; port ARM_R_IMON
MISO: MD1.12(MISO) ; port MISO
MOSI: MD1.11(MOSI) ; port MOSI
OC_5V: MD1.35(TX8) ; port OC_5V
OC_ARM_L: MD1.4(BCLK2) ; port ARM_L_OC
OC_ARM_R: MD1.29(TX7) ; port ARM_R_OC
RST: MD1.2(OUT2) ; port RST
SCK: MD1.13(SCK) ; port SCK
SCL0: MD1.19(A5) R40.1 TP20.1 ; port MCU_SCL0
SCL1: MD1.16(A2) R38.1 TP18.1 ; port MCU_SCL1
SCL2: MD1.24(A10) R36.1 TP16.1 ; port MCU_SCL2
SDA0: MD1.18(A4) R39.1 TP19.1 ; port MCU_SDA0
SDA1: MD1.17(A3) R37.1 TP17.1 ; port MCU_SDA1
SDA2: MD1.25(A11) R35.1 TP15.1 ; port MCU_SDA2
Vtemp_5V: MD1.41(A17) ; port TEMP_5V
Vtemp_L: MD1.38(A14) ; port ARM_L_TEMP
Vtemp_R: MD1.39(A15) ; port ARM_R_TEMP
NetMD1_0: MD1.0(RX1) TP30.1
NetMD1_1: MD1.1(TX1) TP31.1
NetMD1_5: MD1.5(IN2) TP11.1 ; port LED_DOUT
NetMD1_7: MD1.7(RX2) TP32.1
NetMD1_8: MD1.8(TX2) TP33.1
NetMD1_9: MD1.9(OUT1C) Q7.2(S) R29.1 TP12.1
NetMD1_21: MD1.21(A7) TP34.1
NetMD1_22: MD1.22(A8) TP35.1
NetMD1_30: MD1.30(CRX3) Q8.2(S) R32.1 TP13.1
NetMD1_31: MD1.31(CTX3) Q9.2(S) R34.1 TP14.1

Not connected (* = marked no-connect by the designer): MD1 3.3V_1(3.3V) 3.3V_2(3.3V) 3.3V_3(3.3V) 5V 14(A0) 15(A1) 20(A6) 23(A9) 28(RX7) 32(OUT1B) 36(CS2) 37(CS3) D+ D- LED ON/OFF PROGRAM R+ R- T+ T- VBAT VUSB

### Notes on the sheet
- Display
- 5V to 3v3 Level Shifters
- I2C0 - Current Sense
  I2C1 - Left arm encoders
  I2C2 - Right arm encoders

### Library data of the parts
MD1 = CMP-020-00023-1: iMXRT1062 Microcontroller Development Board 600MHz CPU 1GB RAM 8MB Flash
Q7-Q9 = CMP-07173-000101-1: as Q5 on sheet Student Arm; Lead Free: Lead Free; Length: 2.92mm; Width: 1.3mm; Drain to Source Breakdown Voltage: 50V; Min Operating Temperature: -55°C; REACH SVHC: No SVHC; Packaging: Tape and Reel; Radiation Hardening: No; Height: 0.93mm; Drain to Source Voltage (Vdss): 50V; Current Rating: 220mA; Voltage Rating (DC): 50V; Weight: 0.03g; Continuous Drain Current (ID): 220mA; Number of Pins: 3; Nominal Vgs: 1.3V; Max Power Dissipation: 360mW; Fall Time: 9ns; Drain to Source Resistance: 3.5R; Contact Plating: Tin; Case/Package: SOT-23; Package Quantity: 1; Dual Supply Voltage: 50V; Mount: Surface Mount; Termination: SMD/SMT; Max Operating Temperature: 150°C
R29-R40 = CMP-009-00017-7: as R11 on sheet Student Arm; RoHS Compliant: True; Min Operating Temperature: -55°C; Pins: 2; Mounting Technology: SM; Max Operating Temperature: 155°C; Tolerance: 1%
TP11-TP20 TP30-TP35 = CMP-002-00072-5: as TP1 on sheet Student Arm; Pins: 2; Max Operating Temperature: 125°C; Case/Package: 0603; Mounting Technology: Surface Mount; RoHS Compliant: Yes; Min Operating Temperature: -55°C